# EAGLE schematic NQSMHS-SMD (EAGLE 6.4)
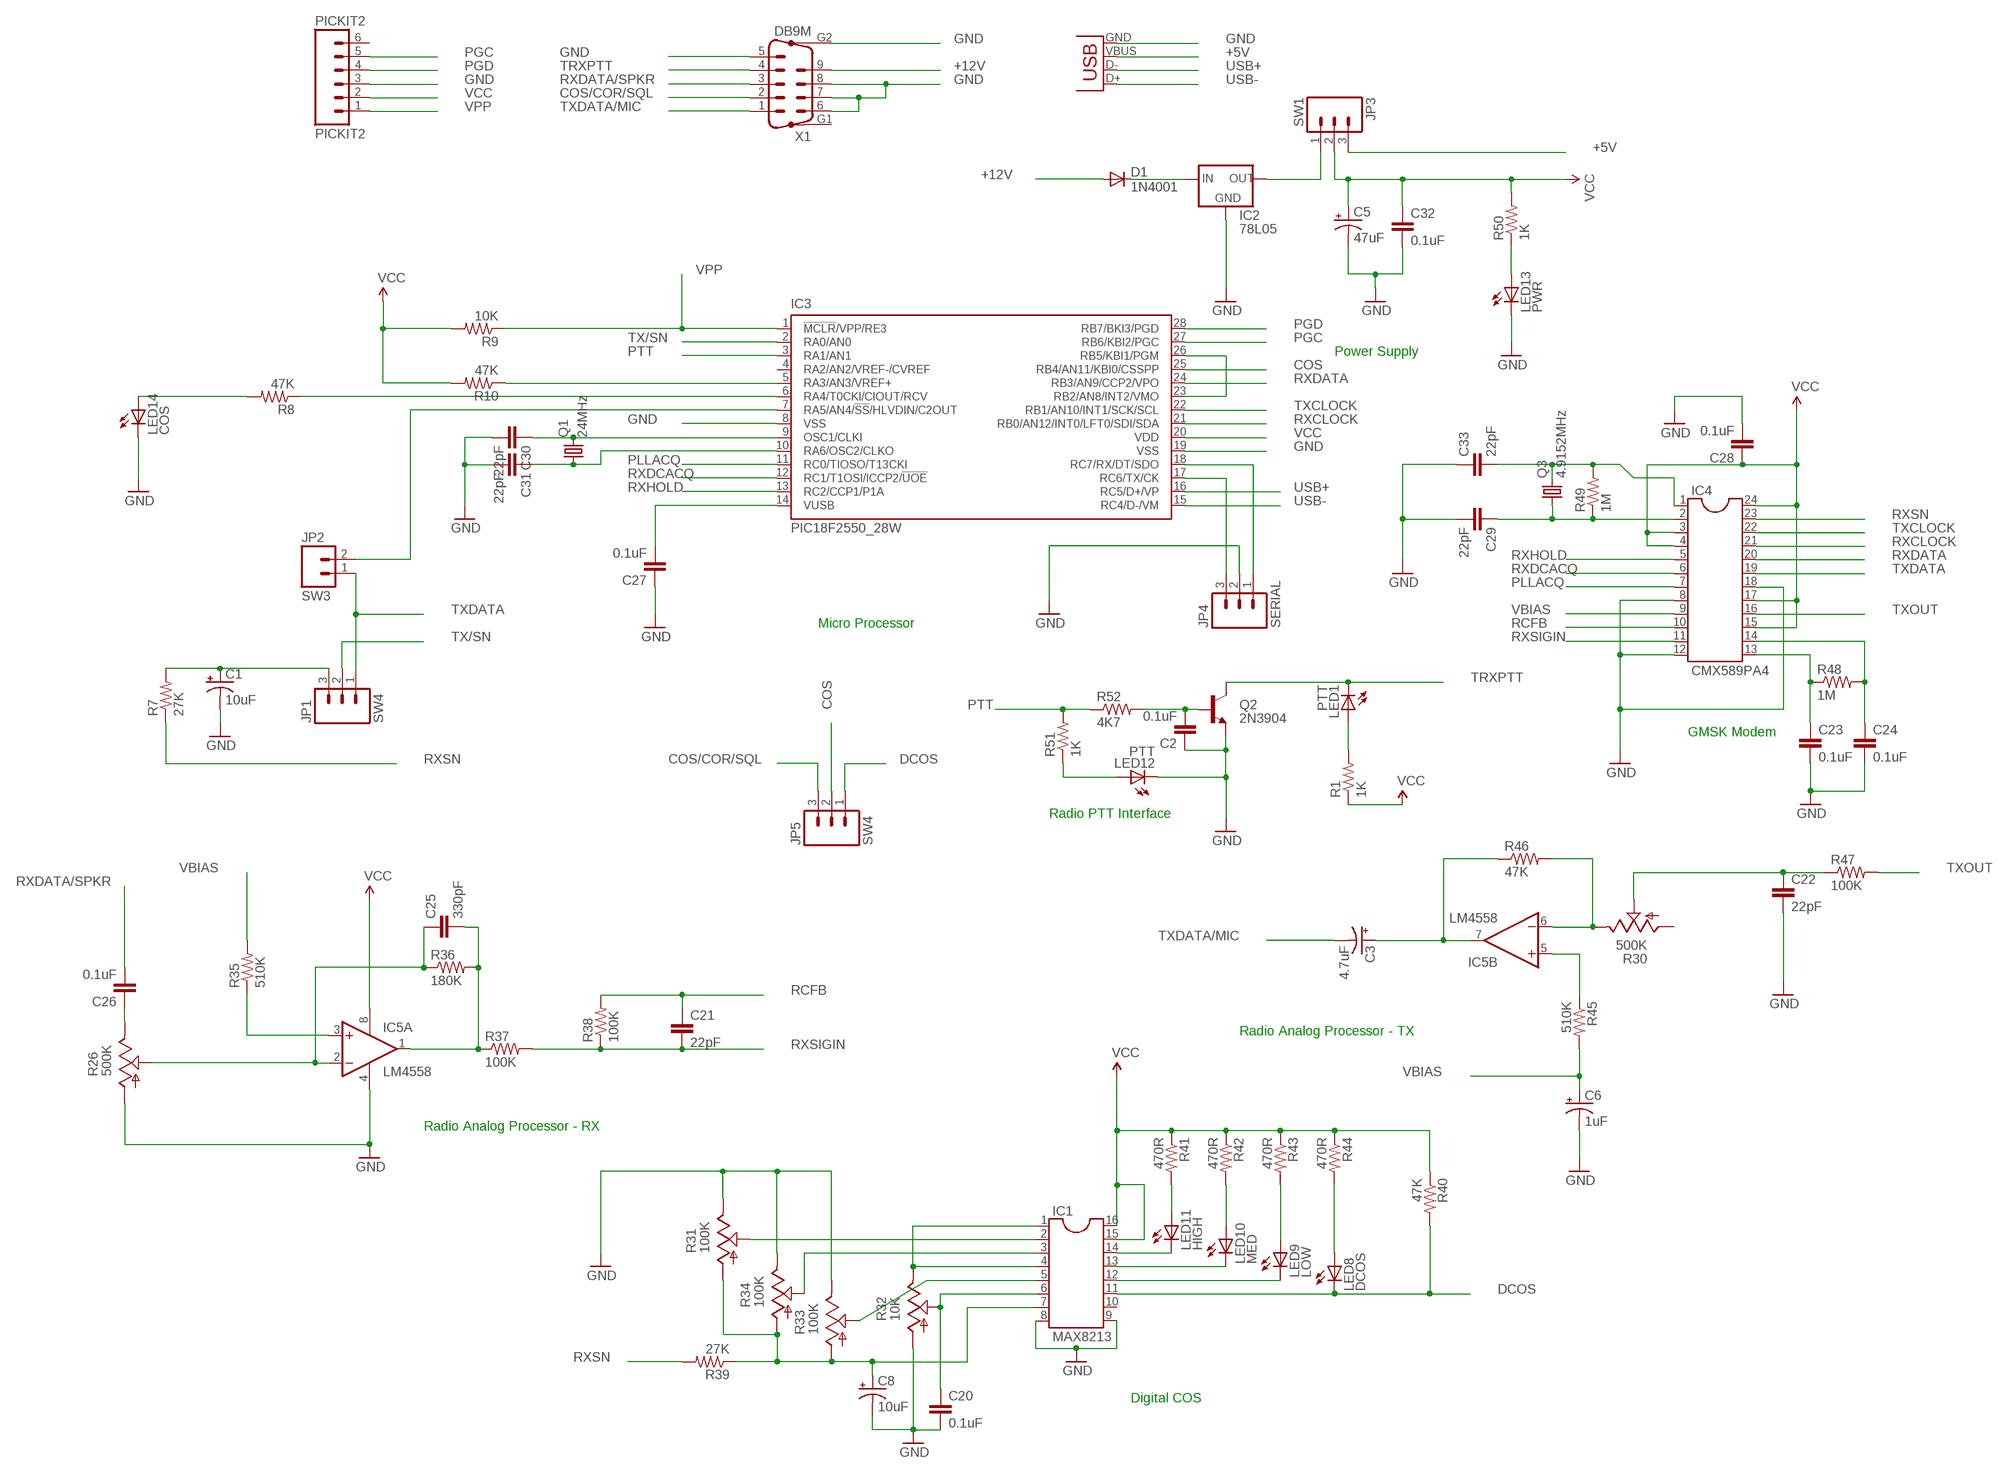
[diagram p0: schematic, sheet 1]

## Parts
C1  10uF  CAP_POLPTH1  [CPOL-RADIAL-100UF-25V]
C2  0.1uF  C-EUC0805  [C0805]
C3  4.7uF  CAP_POLPTH2  [CPOL-RADIAL-10UF-25V]
C5  47uF  CAP_POLPTH2  [CPOL-RADIAL-10UF-25V]
C6  1uF  CAP_POLPTH2  [CPOL-RADIAL-10UF-25V]
C8  10uF  CAP_POLPTH2  [CPOL-RADIAL-10UF-25V]
C20  0.1uF  C-EUC0805  [C0805]
C21  22pF  C-EUC0805  [C0805]
C22  22pF  C-EUC0805  [C0805]
C23  0.1uF  C-EUC0805  [C0805]
C24  0.1uF  C-EUC0805  [C0805]
C25  330pF  C-EUC0805  [C0805]
C26  0.1uF  C-EUC0805  [C0805]
C27  0.1uF  C-EUC0805  [C0805]
C28  0.1uF  C-EUC0805  [C0805]
C29  22pF  C-EUC0805  [C0805]
C30  22pF  C-EUC0805  [C0805]
C31  22pF  C-EUC0805  [C0805]
C32  0.1uF  C-EUC0805  [C0805]
C33  22pF  C-EUC0805  [C0805]
D1  1N4001  DIODESOT23  [SOT23-3]
IC1  MAX8213  DIL16  [DIL16]
IC2  78L05  78LXX  [78LXX]
IC3  PIC18F2550_28W  [SO28W]
IC4  CMX589PA4  DIL24-6  [DIL24-6]
IC5  LM4558  OPA2344U  [SO08]
J1  USBSMD  [USB-MINIB]
JP1  SW4  M03PTH  [1X03]
JP2  SW3  M02PTH  [1X02]
JP3  SW1  M03PTH  [1X03]
JP4  SERIAL  M03PTH  [1X03]
JP5  SW4  M03PTH  [1X03]
LED1  PTT  LEDCHIP-LED0805  [CHIP-LED0805]
LED8  DCOS  LEDCHIP-LED0805  [CHIP-LED0805]
LED9  LOW  LEDCHIP-LED0805  [CHIP-LED0805]
LED10  MED  LEDCHIP-LED0805  [CHIP-LED0805]
LED11  HIGH  LEDCHIP-LED0805  [CHIP-LED0805]
LED12  PTT  LEDCHIP-LED0805  [CHIP-LED0805]
LED13  PWR  LEDCHIP-LED0805  [CHIP-LED0805]
LED14  COS  LEDCHIP-LED0805  [CHIP-LED0805]
PICKIT2  PICKIT2  M06SIP  [1X06]
Q1  24MHz  CRYSTAL10.5X4.8  [CRYSTAL-SMD-10.5X4.8-2PIN]
Q2  2N3904  TRANSISTOR_NPNSOT23  [SOT23]
Q3  4.9152MHz  CRYSTAL10.5X4.8  [CRYSTAL-SMD-10.5X4.8-2PIN]
R1  1K  R-US_R0805  [R0805]
R7  27K  R-US_R0805  [R0805]
R8  47K  R-US_R0805  [R0805]
R9  10K  R-US_R0805  [R0805]
R10  47K  R-US_R0805  [R0805]
R26  500K  TRIM_US-CA6V  [CA6V]
R30  500K  TRIM_US-CA6V  [CA6V]
R31  100K  TRIM_US-CA6V  [CA6V]
R32  10K  TRIM_US-CA6V  [CA6V]
R33  100K  TRIM_US-CA6V  [CA6V]
R34  100K  TRIM_US-CA6V  [CA6V]
R35  510K  R-US_R0805  [R0805]
R36  180K  R-US_R0805  [R0805]
R37  100K  R-US_R0805  [R0805]
R38  100K  R-US_R0805  [R0805]
R39  27K  R-US_R0805  [R0805]
R40  47K  R-US_R0805  [R0805]
R41  470R  R-US_R0805  [R0805]
R42  470R  R-US_R0805  [R0805]
R43  470R  R-US_R0805  [R0805]
R44  470R  R-US_R0805  [R0805]
R45  510K  R-US_R0805  [R0805]
R46  47K  R-US_R0805  [R0805]
R47  100K  R-US_R0805  [R0805]
R48  1M  R-US_R0805  [R0805]
R49  1M  R-US_R0805  [R0805]
R50  1K  R-US_R0805  [R0805]
R51  1K  R-US_R0805  [R0805]
R52  4K7  R-US_R0805  [R0805]
X1  DB9M  M09HP  [M09HP]

## Nets
+5V: J1.VBUS JP3.3
+12V: D1.1(A) X1.9
COS: IC3.25(RB4/AN11/KBI0/CSSPP) JP5.2
COS/COR/SQL: JP5.3 X1.2
DCOS: IC1.11 JP5.1 LED8.C R40.2
GND: C1.2(-) C2.1 C5.2(-) C6.2(-) C8.2(-) C20.2 C22.2 C23.2 C24.2 C27.1 C28.2 C29.2 C30.2 C31.2 C32.2 C33.1 IC1.8 IC1.9 IC2.GND IC3.8(VSS) IC3.19(VSS) IC4.8 IC4.12 IC4.18 IC5.4(A:V-) J1.GND JP4.2 LED12.C LED13.C LED14.C PICKIT2.3 Q2.2(E) R26.A R31.E R32.A R33.E R34.E X1.5 X1.6 X1.7 X1.8 X1.G2
N$1: LED1.A R1.2
N$2: D1.3(C) IC2.IN
N$4: IC3.5(RA3/AN3/VREF+) R10.1
N$5: IC3.6(RA4/T0CKI/CIOUT/RCV) R8.1
N$6: LED14.A R8.2
N$7: IC3.7(RA5/AN4/!SS!/HLVDIN/C2OUT) JP2.2
N$8: C1.1(+) JP1.3 R7.2
N$9: C30.1 IC3.9(OSC1/CLKI) Q1.P$2
N$10: C31.1 IC3.10(RA6/OSC2/CLKO) Q1.P$1
N$11: C27.2 IC3.14(VUSB)
N$12: IC2.OUT JP3.1
N$13: LED13.A R50.1
N$14: C2.2 Q2.1(B) R52.2
N$15: C25.2 IC5.1(A:OUT) R36.2 R37.1
N$16: LED12.A R51.1
N$17: IC5.3(A:+IN) R35.1
N$18: C25.1 IC5.2(A:-IN) R26.S R36.1
N$19: IC5.6(B:-IN) R30.E R46.2
N$20: C26.1 R26.E
N$21: C22.1 R30.S R47.1
N$22: C3.1(+) IC5.7(B:OUT) R46.1
N$23: C8.1(+) IC1.7 R31.A R33.A R34.A R39.1
N$24: IC5.5(B:+IN) R45.1
N$25: C20.1 IC1.6 R32.S
N$27: IC1.1 IC1.4 R32.E
N$28: IC1.14 LED11.C
N$29: LED11.A R41.2
N$30: IC1.13 LED10.C
N$31: LED10.A R42.2
N$32: IC1.12 LED9.C
N$33: IC1.2 R31.S
N$34: LED8.A R44.2
N$35: LED9.A R43.2
N$36: IC1.5 R33.S
N$38: C33.2 IC4.1 Q3.P$2 R49.2
N$39: IC1.3 R34.S
N$42: C23.1 IC4.13 R48.1
N$43: C24.1 IC4.14 R48.2
N$46: IC3.23(RB2/AN8/INT2/VMO) IC3.26(RB5/KBI1/PGM)
N$53: IC3.17(RC6/TX/CK) JP4.3
N$54: IC3.18(RC7/RX/DT/SDO) JP4.1
N$59: C29.1 IC4.2 Q3.P$1 R49.1
PGC: IC3.27(RB6/KBI2/PGC) PICKIT2.5
PGD: IC3.28(RB7/BKI3/PGD) PICKIT2.4
PLLACQ: IC3.11(RC0/TIOSO/T13CKI) IC4.7
PTT: IC3.3(RA1/AN1) R51.2 R52.1
RCFB: C21.1 IC4.10 R38.2
RXCLOCK: IC3.21(RB0/AN12/INT0/LFT0/SDI/SDA) IC4.21
RXDATA: IC3.24(RB3/AN9/CCP2/VPO) IC4.20
RXDATA/SPKR: C26.2 X1.3
RXDCACQ: IC3.12(RC1/T1OSI/ICCP2/!UOE) IC4.6
RXHOLD: IC3.13(RC2/CCP1/P1A) IC4.5
RXSIGIN: C21.2 IC4.11 R37.2 R38.1
RXSN: IC4.23 R7.1 R39.2
TRXPTT: LED1.C Q2.3(C) X1.4
TX/SN: IC3.2(RA0/AN0) JP1.2
TXCLOCK: IC3.22(RB1/AN10/INT1/SCK/SCL) IC4.22
TXDATA: IC4.19 JP1.1 JP2.1
TXDATA/MIC: C3.2(-) X1.1
TXOUT: IC4.16 R47.2
USB+: IC3.16(RC5/D+/VP) J1.D-
USB-: IC3.15(RC4/D-/VM) J1.D+
VBIAS: C6.1(+) IC4.9 R35.2 R45.2
VCC: C5.1(+) C28.1 C32.1 IC1.15 IC1.16 IC3.20(VDD) IC4.3 IC4.4 IC4.15 IC4.17 IC4.24 IC5.8(A:V+) JP3.2 PICKIT2.2 R1.1 R9.2 R10.2 R40.1 R41.1 R42.1 R43.1 R44.1 R50.2
VPP: IC3.1(!MCLR!/VPP/RE3) PICKIT2.1 R9.1
Unconnected: IC1.10 IC3.4(RA2/AN2/VREF-/CVREF) PICKIT2.6 R30.A X1.G1

## Notes on the sheet
- Power Supply
- Micro Processor
- GMSK Modem
- Radio PTT Interface
- Radio Analog Processor - TX
- Radio Analog Processor - RX
- Digital COS

## Library data of the parts
C1 C3 C5 C6 C8 = SparkFun:CAP_POL: Capacitor Polarized These are standard SMD and PTH capacitors. Normally 10uF, 47uF, and 100uF in electrolytic and tantalum varieties. Always verify the external diameter of the through hole cap, it varies with capacity, voltage, and manufacturer. The EIA devices should be standard.
C2 C20-C33 = rcl:C-EU: CAPACITOR, European symbol
D1 = SparkFun:DIODE: Diode These are standard reverse protection diodes and small signal diodes. SMA package can handle up to about 1A. SOD-323 can handle about 200mA. What the SOD-323 package when ordering, there are some mfgs out there that are 5-pin packages.
IC1 = ic-package:DIL16: Dual In Line / Socket
IC2 = v-reg:78LXX: VOLTAGE REGULATOR
IC3 = microchip:PIC18F2*_28: USB Microcontrollers with nanoWatt Technology High-Performance, Enhanced Flash, 28/40/44-Pin, Source: http://ww1.microchip.com/downloads/en/devicedoc/39632c.pdf
IC4 = ic-package:DIL24: Dual In Line
IC5 = linear:OPA2*: Dual Operational Amplifier Low Power, Single-Supply, Rail-To-Rail Operational Amplifier Source: http://focus.ti.com/lit/ds/symlink/opa2345.pdf http://focus.ti.com .. opa241.pdf http://focus.ti.com/lit/ds/symlink/opa2134.pdf
J1 = SparkFun:USB: USB Connectors USB-B-PTH is fully proven SKU : PRT-00139 USB-miniB is fully proven SKU : PRT-00587 USB-A-PCB is untested. USB-A-H is throughly reviewed, but untested. Spark Fun Electronics SKU : PRT-00437 USB-B-SMT is throughly reviewed, but untested. Needs silkscreen touching up. USB-A-S has not been used/tested USB-MB-H has not been used/tested
JP1 JP3-JP5 = SparkFun:M03: Header 3 Standard 3-pin 0.1" header. Use with straight break away headers (SKU : PRT-00116), right angle break away headers (PRT-00553), swiss pins (PRT-00743), machine pins (PRT-00117), and female headers (PRT-00115). Molex polarized connector foot print use with SKU : PRT-08232 with associated crimp pins and housings.
JP2 = SparkFun:M02: Header 2 Standard 2-pin 0.1" header. Use with straight break away headers (SKU : PRT-00116), right angle break away headers (PRT-00553), swiss pins (PRT-00743), machine pins (PRT-00117), and female headers (PRT-00115). Molex polarized connector foot print use with SKU : PRT-08233 with associated crimp pins and housings.
LED1 LED8-LED14 = led:LED: LED OSRAM: - CHIPLED LG R971, LG N971, LY N971, LG Q971, LY Q971, LO R971, LY R971 LH N974, LH R974 LS Q976, LO Q976, LY Q976 LO Q996 - Hyper CHIPLED LW Q18S LB Q993, LB Q99A, LB R99A - SideLED LS A670, LO A670, LY A670, LG A670, LP A670 LB A673, LV A673, LT A673, LW A673 LH A674 LY A675 LS A676, LA A676, LO A676, LY A676, LW A676 LS A679, LY A679, LG A679 - Hyper Micro SIDELED® LS Y876, LA Y876, LO Y876, LY Y876 LT Y87S - SmartLED LW L88C, LW L88S LB L89C, LB L89S, LG L890 LS L89K, LO L89K, LY L89K LS L896, LA L896, LO L896, LY L896 - TOPLED LS T670, LO T670, LY T670, LG T670, LP T670 LSG T670, LSP T670, LSY T670, LOP T670, LYG T670 LG T671, LOG T671, LSG T671 LB T673, LV T673, LT T673, LW T673 LH T674 LS T676, LA T676, LO T676, LY T676, LB T676, LH T676, LSB T676, LW T676 LB T67C, LV T67C, LT T67C, LS T67K, LO T67K, LY T67K, LW E67C LS E67B, LA E67B, LO E67B, LY E67B, LB E67C, LV E67C, LT E67C LW T67C LS T679, LY T679, LG T679 LS T770, LO T770, LY T770, LG T770, LP T770 LB T773, LV T773, LT T773, LW T773 LH T774 LS E675, LA E675, LY E675, LS T675 LS T776, LA T776, LO T776, LY T776, LB T776 LHGB T686 LT T68C, LB T68C - Hyper Mini TOPLED® LB M676 - Mini TOPLED Santana® LG M470 LS M47K, LO M47K, LY M47K Source: http://www.osram.convergy.de LUXEON: - LUMILED® LXK2-PW12-R00, LXK2-PW12-S00, LXK2-PW14-U00, LXK2-PW14-V00 LXK2-PM12-R00, LXK2-PM12-S00, LXK2-PM14-U00 LXK2-PE12-Q00, LXK2-PE12-R00, LXK2-PE12-S00, LXK2-PE14-T00, LXK2-PE14-U00 LXK2-PB12-K00, LXK2-PB12-L00, LXK2-PB12-M00, LXK2-PB14-N00, LXK2-PB14-P00, LXK2-PB14-Q00 LXK2-PR12-L00, LXK2-PR12-M00, LXK2-PR14-Q00, LXK2-PR14-R00 LXK2-PD12-Q00, LXK2-PD12-R00, LXK2-PD12-S00 LXK2-PH12-R00, LXK2-PH12-S00 LXK2-PL12-P00, LXK2-PL12-Q00, LXK2-PL12-R00 Source: www.luxeon.com KINGBRIGHT: KA-3528ASYC Source: www.kingbright.com
PICKIT2 = SparkFun:M06: Header 6 Standard 6-pin 0.1" header. Use with straight break away headers (SKU : PRT-00116), right angle break away headers (PRT-00553), swiss pins (PRT-00743), machine pins (PRT-00117), and female headers (PRT-00115). Molex polarized connector foot print use with SKU : PRT-08094 with associated crimp pins and housings. NOTES ON THE VARIANTS LOCK and LOCK_LONGPADS... This footprint was designed to help hold the alignment of a through-hole component (i.e. 6-pin header) while soldering it into place. You may notice that each hole has been shifted either up or down by 0.005 of an inch from it's more standard position (which is a perfectly straight line). This slight alteration caused the pins (the squares in the middle) to touch the edges of the holes. Because they are alternating, it causes a "brace" to hold the component in place. 0.005 has proven to be the perfect amount of "off-center" position when using our standard breakaway headers. Although looks a little odd when you look at the bare footprint, once you have a header in there, the alteration is very hard to notice. Also, if you push a header all the way into place, it is covered up entirely on the bottom side. This idea of altering the position of holes to aid alignment will be further integrated into the Sparkfun Library for other footprints. It can help hold any component with 3 or more connection pins.
Q1 Q3 = SparkFun:CRYSTAL: Crystals Various standard crystals. Proven footprints. Spark Fun Electronics SKU : COM-00534
Q2 = SparkFun:TRANSISTOR_NPN: Transistor NPN BJT configuration in SOT23 package. MMBT2222 is the common NPN we use. Double check BCE configuration again layout.
R1 R7-R10 R35-R52 = resistor:R-US_: RESISTOR, American symbol
R26 R30-R34 = pot:TRIM_US-: POTENTIOMETER
X1 = con-subd:M09HP: SUB-D